# Altium schematic sheet PROGRAMMING.SchDoc: PROGRAMMING
size A; SheetNumber: 6; SheetTotal: 8
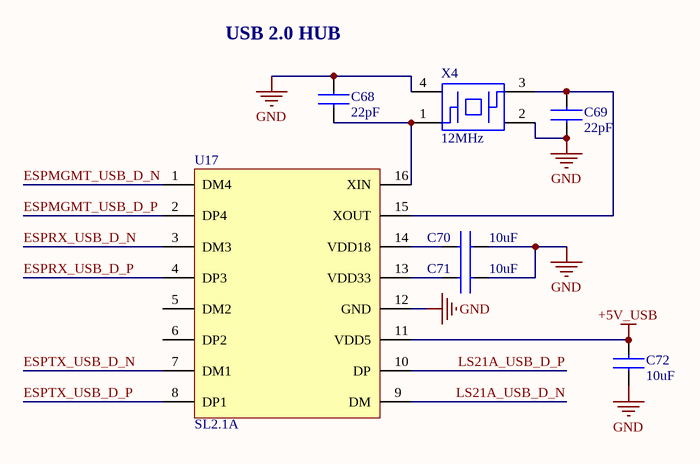
[diagram p0: PROGRAMMING.SchDoc]

## Parts
C68  22pF  [CAP_0402]
C69  22pF  [CAP_0402]
C70  10uF  [CAP_0402]
C71  10uF  [CAP_0402]
C72  10uF  [CAP_0402]
U17  SL2.1A  [IC_SL2.1A]
X4  12MHz  [XTAL_TAXM12M4RLBDDT2T]

## Nets
+5V_USB: C72.2 U17.11(VDD5)
GND: C68.2 C69.1 C70.2 C71.2 C72.1 U17.12(GND) X4.2(GND) X4.4
ESPMGMT_USB_D_N: U17.1(DM4)
ESPMGMT_USB_D_P: U17.2(DP4)
ESPRX_USB_D_N: U17.3(DM3)
ESPRX_USB_D_P: U17.4(DP3)
ESPTX_USB_D_N: U17.7(DM1)
ESPTX_USB_D_P: U17.8(DP1)
LS21A_USB_D_N: U17.9(DM)
LS21A_USB_D_P: U17.10(DP)
NetC68_1: C68.1 U17.16(XIN) X4.1(IN/OUT)
NetC69_2: C69.2 U17.15(XOUT) X4.3
NetC70_1: C70.1 U17.14(VDD18)
NetC71_1: C71.1 U17.13(VDD33)

Not connected (* = marked no-connect by the designer): U17 5(DM2) 6(DP2)

## Notes on the sheet
- (near C68) USB 2.0 HUB

## Library data of the parts
C68 C69 = CAP_0402CG220J500NT: MULTILAYER CERAMIC CAPACITORS MLCC - SMD/SMT 22PF 50V 0402 ROHS 0402CG220J500NT; Type: Basic; Datasheet: https://datasheet.lcsc.com/szlcsc/Guangdong-Fenghua-Advanced-Tech-0402CG220J500NT_C1555.pdf; MFR Part #: 0402CG220J500NT; LCSC Part#: C1555; Value: 22pF
C70-C72 = CAP_CL05A106MQ5NUNC: Cap Ceramic 10uF 6.3V X5R 20% SMD 0402 85°C Paper T/R; Manufacturer: Samsung; Supplier 1: Digi-Key; Manufacturer Part Number: CL05A106MQ5NUNC; RoHS: Yes; Category: Ceramic Capacitors; Stock 1: 3345553; Pricing 1: 1=0.27000, 10=0.18400, 50=0.11020, 100=0.09300, 500=0.06362, 1000=0.05629, 2500=0.05384, 5000=0.04894 (USD); Mount: Surface Mount; Case/Package: 0402; Case Code (Metric): 1005; Case Code (Imperial): 0402; Min Operating Temperature: -55°C; Max Operating Temperature: 85°C; Tolerance: 20%; Capacitance: 10uF; Dielectric: X5R; Packaging: Tape and Reel; Package Quantity: 1; Voltage Rating: 6.3V; Series: CL; Construction: Flat; Length: 1mm; Width: 0.02inch; Height: 0.5mm; Thickness: 0.028inch; Depth: 0.5mm; Radiation Hardening: No; ComponentLink1URL: https://datasheet.ciiva.com/16437/cl05a106mq5nunc-16437356.pdf?src-supplier=Future+Electronics; ComponentLink1Description: https://datasheet.ciiva.com/16437/cl05a106mq5nunc-16437356.pdf?src-supplier=Future+Electronics; ComponentLink2URL: https://datasheet.ciiva.com/26877/getdatasheetpartid-355289-26877841.pdf?src-supplier=Verical; ComponentLink2Description: https://datasheet.ciiva.com/26877/getdatasheetpartid-355289-26877841.pdf?src-supplier=Verical; Supplier Part Number 1: 1276-1451-1-ND
U17 = IC_SL2.1A: USB 2.0 HIGH SPEED 4-PORT HUB CONTROLLER; MF: CoreChips ShenZhen CO.,Ltd; Check_prices: https://www.snapeda.com/parts/SL2.1A/CoreChips%20ShenZhen%20CO.,Ltd/view-part/4219225/?ref=eda; Price: None; Availability: No availability data; Value: *; SnapEDA_Link: https://www.snapeda.com/parts/SL2.1A/CoreChips%20ShenZhen%20CO.,Ltd/view-part/4219225/?ref=snap; MP: SL2.1A; Package: Package; Supplier 1: LCSC; Supplier Part Number 1: C192893
X4 = XTAL_TAXM12M4RLBDDT2T: Manufacturer: TAE(Zhejiang Abel Elec); Supplier 1: LCSC; Manufacturer Part Number: TAXM12M4RLBDDT2T; RoHS: No; Category: Uncategorized; Stock 1: 105435; Pricing 1: 5=0.0594, 50=0.048, 150=0.0421, 500=0.0374, 3000=0.0357, 6000=0.0345 (USD); Supplier Part Number 1: C133334